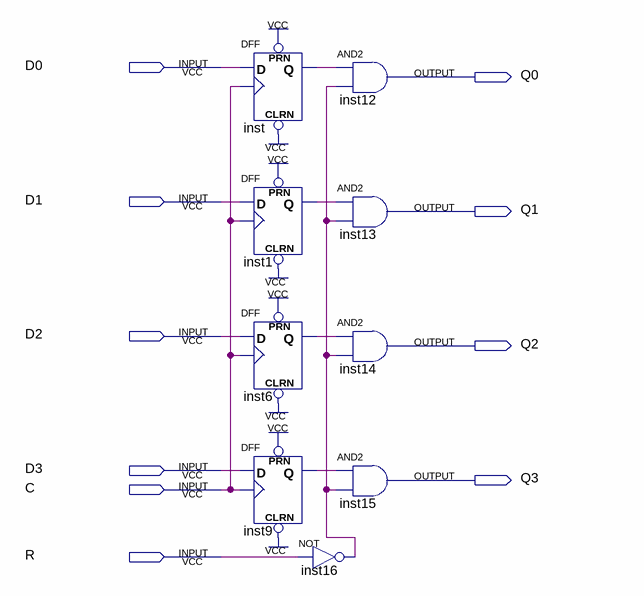
[diagram p0: schematic sheet]
// Quartus schematic RG.bdf as structural Verilog: 9 symbols, 10 pins
module RG (
  input  D0,
  input  D1,
  input  D2,
  input  D3,
  input  C,
  input  R,
  output Q0,
  output Q1,
  output Q2,
  output Q3
);

  wire inst1_q, inst6_q, inst9_q, inst16_out, inst_q;

  DFF inst (.CLRN(1'b1), .CLK(C), .D(D0), .PRN(1'b1), .Q(inst_q));
  DFF inst1 (.CLRN(1'b1), .CLK(C), .D(D1), .PRN(1'b1), .Q(inst1_q));
  DFF inst6 (.CLRN(1'b1), .CLK(C), .D(D2), .PRN(1'b1), .Q(inst6_q));
  DFF inst9 (.CLRN(1'b1), .CLK(C), .D(D3), .PRN(1'b1), .Q(inst9_q));
  and inst12 (Q0, inst_q, inst16_out);
  and inst13 (Q1, inst1_q, inst16_out);
  and inst14 (Q2, inst6_q, inst16_out);
  and inst15 (Q3, inst9_q, inst16_out);
  not inst16 (inst16_out, R);
endmodule
